# EAGLE design CV_slew_limiter copy (EAGLE 6.1)
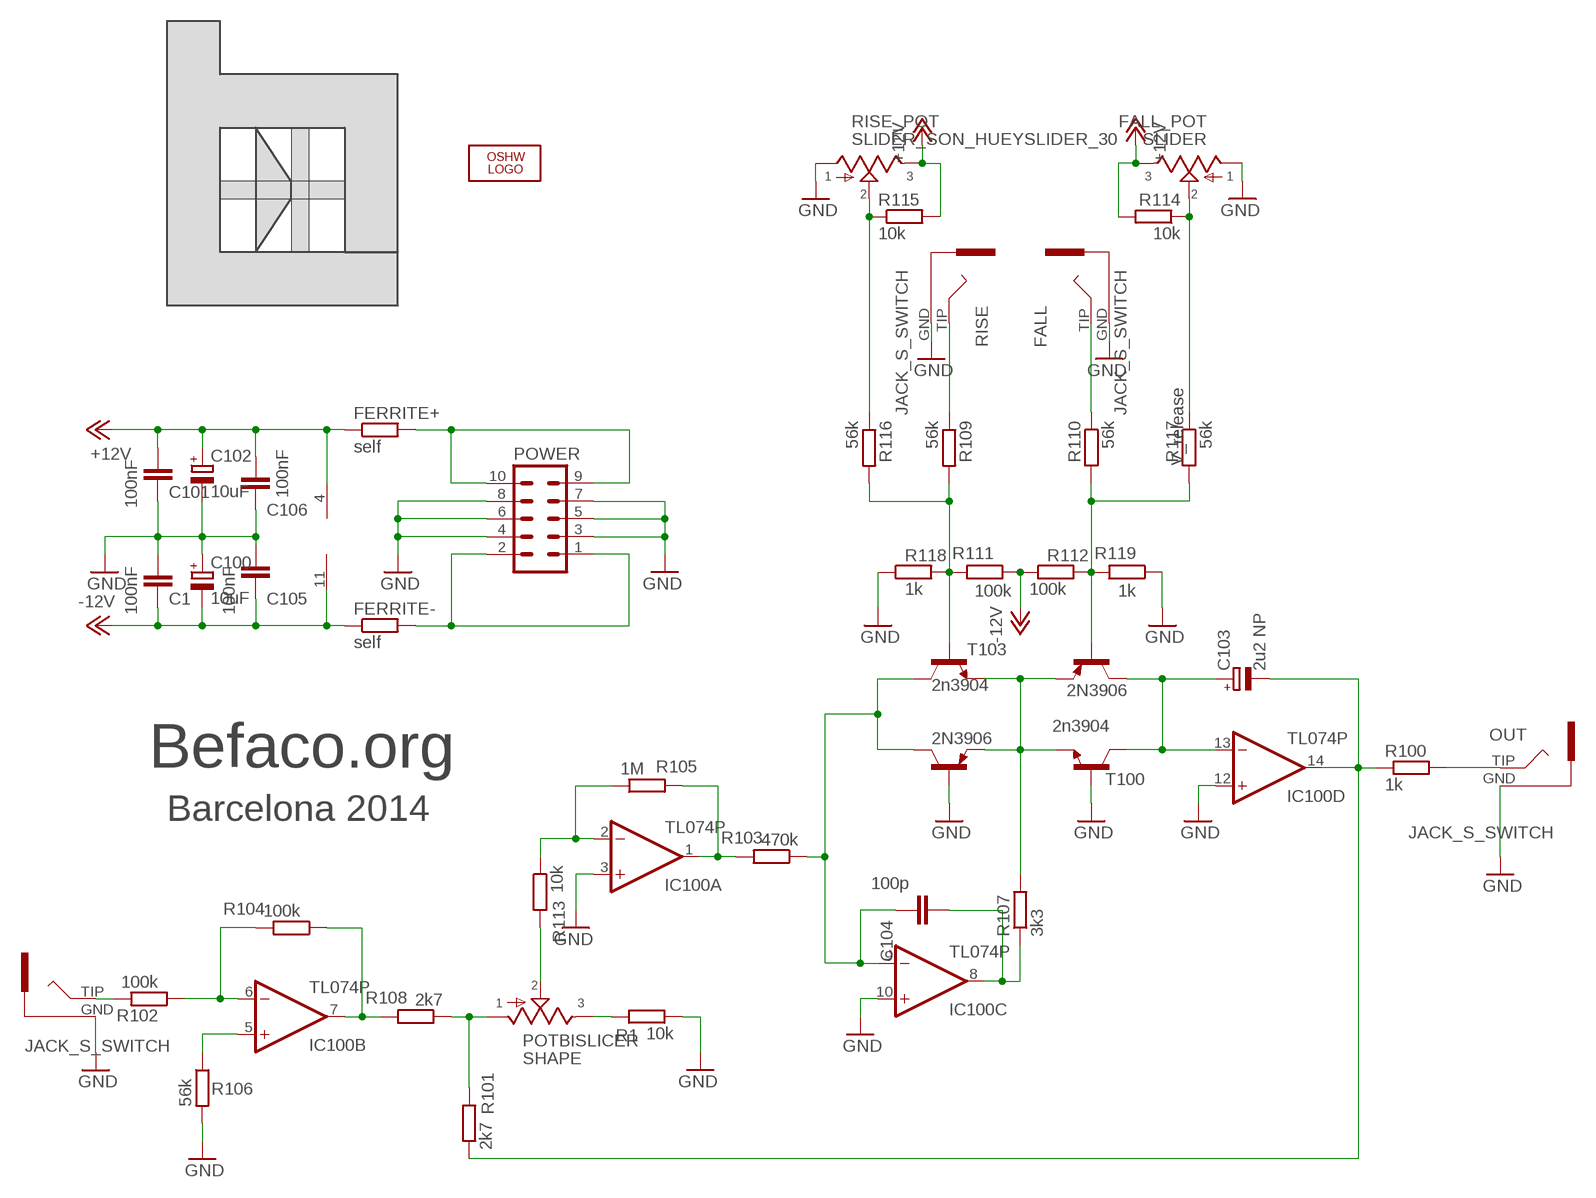
[diagram p0: schematic, sheet 1]

## Parts
C1  100nF  C-EU050-025X075  [C050-025X075]
C100  10uF  CPOL-EUE2-4  [E2-4]
C101  100nF  C-EU050-025X075  [C050-025X075]
C102  10uF  CPOL-EUE2-4  [E2-4]
C103  2u2 NP  CPOL-EUE2-4  [E2-4]
C104  100p  C-EU050-025X075  [C050-025X075]
C105  100nF  C-EU050-025X075  [C050-025X075]
C106  100nF  C-EU050-025X075  [C050-025X075]
FALL  JACK_S_SWITCH  [PJ-360_BANANA_2]
FALL_POT  SLIDER  SLIDER_SON_HUEYSLIDER_30  [SILDER_30]
FERRITE+  self  R-EU_0204/5  [0204/5]
FERRITE-  self  R-EU_0204/5  [0204/5]
IC100  TL074P  [DIL14]
IN  JACK_S_SWITCH  [PJ-360_BANANA_2]
LOGO100  OSHW_LOGO_8MILX0200-NT  [OSHW_8X200_NOTEXT]
OUT  JACK_S_SWITCH  [PJ-360_BANANA_2]
POWER  ML10  [ML10]
R1  10k  R-EU_0204/5  [0204/5]
R100  1k  R-EU_0204/5  [0204/5]
R101  2k7  R-EU_0204/5  [0204/5]
R102  100k  R-EU_0204/5  [0204/5]
R103  470k  R-EU_0204/5  [0204/5]
R104  100k  R-EU_0204/5  [0204/5]
R105  1M  R-EU_0204/5  [0204/5]
R106  56k  R-EU_0204/5  [0204/5]
R107  3k3  R-EU_0204/5  [0204/5]
R108  2k7  R-EU_0204/5  [0204/5]
R109  56k  R-EU_0204/5  [0204/5]
R110  56k  R-EU_0204/5  [0204/5]
R111  100k  R-EU_0204/5  [0204/5]
R112  100k  R-EU_0204/5  [0204/5]
R113  10k  R-EU_0204/5  [0204/5]
R114  10k  R-EU_0204/5  [0204/5]
R115  10k  R-EU_0204/5  [0204/5]
R116  56k  R-EU_0204/5  [0204/5]
R117  56k  R-EU_0204/5  [0204/5]
R118  1k  R-EU_0204/5  [0204/5]
R119  1k  R-EU_0204/5  [0204/5]
RISE  JACK_S_SWITCH  [PJ-360_BANANA_2]
RISE_POT  SLIDER_SON_HUEYSLIDER_30  [SILDER_30]
SHAPE  POTBISLICER  [POTBISLICER]
T100  2n3904  2N3904-NPN-TO92-EBC  [TO92-EBC]
T101  2N3906  2N3906-PNP-TO92-EBC  [TO92-EBC]
T102  2N3906  2N3906-PNP-TO92-EBC  [TO92-EBC]
T103  2n3904  2N3904-NPN-TO92-EBC  [TO92-EBC]
U$100  LOGOBEFACOCONLETRAS  [LOGOBEFACOCONLETRAS_2]

## Nets
+12V: C101.2 C102.+ C106.2 FALL_POT.3 FERRITE+.1 IC100.4(P:V+) R114.2 R115.2 RISE_POT.3
-12V: C1.1 C100.- C105.1 FERRITE-.1 IC100.11(P:V-) R111.1 R112.1
GND: C1.2 C100.+ C101.1 C102.- C105.2 C106.1 FALL.GND FALL_POT.1 IC100.3(A:+IN) IC100.10(C:+IN) IC100.12(D:+IN) IN.GND OUT.GND POWER.3 POWER.4 POWER.5 POWER.6 POWER.7 POWER.8 R1.1 R106.2 R118.1 R119.1 RISE.GND RISE_POT.1 T100.B T102.B
IC25: C103.- IC100.14(D:OUT) R100.1 R101.1
N$1: OUT.TIP R100.2
N$2: R113.2 SHAPE.PIN2
N$3: R101.2 R108.1 SHAPE.PIN1
N$8: FERRITE+.2 POWER.9 POWER.10
N$10: R107.2 T100.E T101.E T102.E T103.E
N$12: C103.+ IC100.13(D:-IN) T100.C T101.C
N$21: IC100.2(A:-IN) R105.1 R113.1
N$22: C104.1 IC100.9(C:-IN) R103.1 T102.C T103.C
N$23: C104.2 IC100.8(C:OUT) R107.1
N$24: R109.1 RISE.TIP
N$28: IC100.1(A:OUT) R103.2 R105.2
N$29: R1.2 SHAPE.PIN3
N$30: IC100.7(B:OUT) R104.1 R108.2
N$33: FERRITE-.2 POWER.1 POWER.2
N$35: IC100.6(B:-IN) R102.1 R104.2
N$37: IC100.5(B:+IN) R106.1
N$39: IN.TIP R102.2
N$46: R115.1 R116.1 RISE_POT.2
N$49: FALL_POT.2 R114.1 R117.1
N$51: FALL.TIP R110.1
TO_ATTACK_CV: R109.2 R111.2 R116.2 R118.2 T103.B
TO_DECCAY_CV: R110.2 R112.2 R117.2 R119.2 T101.B

## Notes on the sheet
- V_release
- Befaco.org
- Barcelona 2014

## Library data of the parts
C1 C101 C104-C106 = rcl:C-EU: CAPACITOR, European symbol
C100 C102 C103 = rcl:CPOL-EU: POLARIZED CAPACITOR, European symbol
FALL IN OUT RISE = minijack_banana:JACK_S_SWITCH
FALL_POT RISE_POT = slider_son_huey:SLIDER_SON_HUEY
FERRITE+ FERRITE- R1 R100-R119 = rcl:R-EU_: RESISTOR, European symbol
IC100 = linear:TL074: OP AMP
LOGO100 = ohw-logo:OSHW_LOGO_8MIL
POWER = con-ml:ML10: HARTING; OC_FARNELL: unknown; OC_NEWARK: unknown
SHAPE = Por bislicer2:POTBISLICER
T100 T103 = transistor-neu-to92:*-NPN-: NPN Transistror
T101 T102 = transistor-neu-to92:*-PNP-: PNP Transistror
U$100 = logo befaco:LOGOBEFACOCONLETRAS

## Board
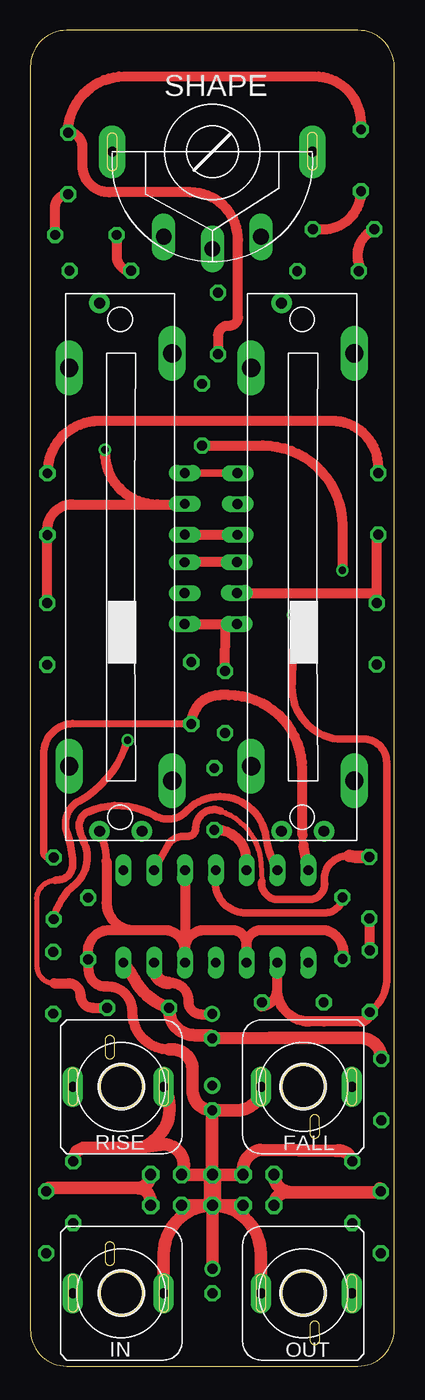
[diagram p1: board, top side]
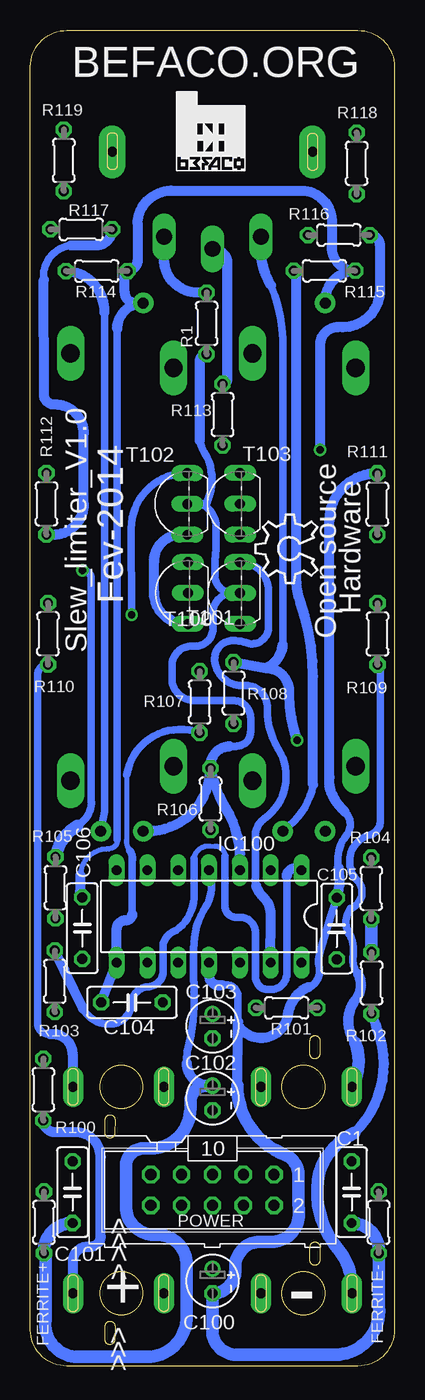
[diagram p2: board, bottom side, seen from below]

Size 30 x 110 mm. Coordinates in mm from the lower left corner, seen from the top.
Outline: 0,107 0,3 arc90 3,0 27,0 arc90 30,3 30,107 arc90 27,110 3,110 arc90 0,107
Copper layers (1*16): Top 0.035mm / dielectric 1.5mm / Bottom 0.035mm
Design rules: minimum track width 6mil, minimum drill 12mil, track to track 6mil, track to pad 6mil, pad to pad 6mil, via to via 6mil, smd to smd 0mil, copper to edge 10mil, drill to drill 10mil, minimum pad ring 10mil, minimum via ring 6mil, stop-mask expansion 2mil, vias tented up to drill 100mil, thermal gap 10mil

### Footprints (pad centres in the part's own frame; a part is rotated, then mirrored left to right if it is on the bottom)
C050-025X075 = drill 0.813 octagon: 1 -2.54,0; 2 2.54,0
E2-4 = drill 0.813 pad 1.27: + -1.016,0 | drill 0.813 pad 1.27 octagon: - 1.016,0
PJ-360_BANANA_2 = drill 0.8 pad 1.676 long: GND 0,-3.5; TIP 0,4
SILDER_30 = drill 0.9 pad 1.676: 1 -21.75,1.8; 2 -21.75,-1.7; 3 21.75,1.8 | drill 1.5 long: P$4 -17.6,-4.2; P$5 -16.4,4.3; P$6 16.4,4.3; P$7 17.6,-4.2
0204/5 = drill 0.813 octagon: 1 -2.54,0; 2 2.54,0
DIL14 = drill 0.813 long: 1 -7.62,-3.81; 2 -5.08,-3.81; 3 -2.54,-3.81; 4 0,-3.81; 5 2.54,-3.81; 6 5.08,-3.81; 7 7.62,-3.81; 8 7.62,3.81; 9 5.08,3.81; 10 2.54,3.81; 11 0,3.81; 12 -2.54,3.81; 13 -5.08,3.81; 14 -7.62,3.81
ML10 = drill 0.914 octagon: 1 -5.08,-1.27; 2 -5.08,1.27; 3 -2.54,-1.27; 4 -2.54,1.27; 5 0,-1.27; 6 0,1.27; 7 2.54,-1.27; 8 2.54,1.27; 9 5.08,-1.27; 10 5.08,1.27
POTBISLICER = drill 0.8 pad 2.184 long: PCB1 -8.25,0; PCB2 8.25,0 | drill 1.3 pad 1.778 long: PIN1 -4,-7; PIN2 0,-8; PIN3 4,-7
TO92-EBC = drill 0.813 long: B 0,-1.27; C 2.54,-1.27; E -2.54,-1.27

### Placement (x,y rotation side)
C1  3.53,14.32 90 bottom
C100  15,7 270 bottom
C101  26.53,14.32 270 bottom
C102  14.99,22.08 270 bottom
C103  14.99,28 270 bottom
C104  21.64,29.95 180 bottom
C105  4.76,36.03 270 bottom
C106  25.73,36.06 90 bottom
FALL  22.5,23 270 top
FALL_POT  22.5,65.8 90 top
FERRITE+  28.89,11.84 90 bottom
FERRITE-  1.3,11.84 90 bottom
IC100  15.28,37.03 180 bottom
IN  7.5,6 90 top
LOGO100  6.37,64.48 90 bottom
OUT  22.5,6 270 top
POWER  15,14.5 180 bottom
R1  15.48,85.87 90 bottom
R100  28.94,22.77 270 bottom
R101  8.88,29.5 0 bottom
R102  1.89,31.56 270 bottom
R103  27.99,31.69 90 bottom
R104  1.91,39.34 270 bottom
R105  27.94,39.4 270 bottom
R106  15.16,46.7 90 bottom
R107  16.05,54.69 90 bottom
R108  13.27,55.43 270 bottom
R109  1.39,60.3 90 bottom
R110  28.55,60.3 90 bottom
R111  1.41,70.98 270 bottom
R112  28.68,71.01 270 bottom
R113  14.16,78.35 90 bottom
R114  24.53,90.18 0 bottom
R115  5.76,90.2 0 bottom
R116  4.58,93.15 0 bottom
R117  25.81,93.61 0 bottom
R118  3.12,99.05 270 bottom
R119  27.26,99.3 270 bottom
RISE  7.5,23 90 top
RISE_POT  7.5,65.8 90 top
SHAPE  15,100 0 top
T100  13.99,63.66 90 bottom
T101  18.3,63.66 90 bottom
T102  18.35,71 90 bottom
T103  14,71.01 90 bottom
U$100  15.37,101.12 0 bottom

### Tracks (layer width: path | path; a pad name or v marks a point on that pad's centre or on a via)
+12V
  Top 0.61: IC100.4 15.24,40.01 arc90 17.58,37.34 24.12,37.34 arc90 C106.2
  Bottom 0.406: 22.85,43.36 arc90 23.35,42.65 23.52,42.58 arc-90 25.89,40.43 | 16.54,31.69 16.54,31.59
  Bottom 0.61: RISE_POT.3 5.7,87.72 | IC100.4 arc55 15.74,37.53 arc-31 16.54,34.35 16.54,31.69 | 22.85,43.36 22.85,85.4 | FALL_POT.3 21.37,87.55 | 22.22,90.18 arc-90 R114.2 | 16.54,31.79 16.54,31.59 16.52,30.74 arc16 17.03,26.15 arc-21 17.11,24.94
  Bottom 0.813: 5.7,87.72 arc90 R115.2 arc90 5.18,92.16 5.18,93.89 arc-90 7.38,96.79 18.18,96.79 arc-90 21.19,94.15 21.17,91.23 arc90 R114.2 | 25.89,40.43 25.89,39.15 arc-90 C106.2 | 22.85,85.4 arc90 FALL_POT.3 | 21.37,87.55 arc90 22.22,88.4 22.22,90.18 | C102.+ 15.27,23.1 arc90 17.11,24.94
  Bottom 1.016: 15.27,23.1 15.5,23.1 arc-90 16.82,21.78 16.82,21.22 arc90 20.11,17.92 20.69,17.92 arc-90 22.14,16.48 22.14,13.14 arc-90 19.81,10.82 19.55,10.82 arc90 17.14,8.41 17.14,4.42 arc90 20.1,0.77 26.37,0.77 arc90 28.75,3.8 28.75,9.16 arc-90 FERRITE+.1 28.89,9.42 arc90 C101.2
-12V
  Top 0.813: R112.1 28.68,74.03 arc90 24.87,77.83 5.63,77.83 arc90 R111.1
  Bottom 0.61: 12.88,28.38 12.89,30.36 arc-90 13.79,31.39 14.19,31.39 | 4.62,41.03 arc50 3.96,43.7 arc-86 4.1,45.67 | C105.1 arc-3 6.16,34.08 arc-27 6.21,32.79 arc80 7.05,31.21
  Bottom 0.813: 12.96,23.13 12.89,28.08 | 12.89,28.08 12.88,28.38 | 14.19,31.39 arc90 15.23,31.91 15.22,33.2 arc-90 IC100.11 | C105.1 arc-31 4.62,41.03 | 4.1,45.67 arc21 5.12,47.04 arc33 5.35,48.49 5.35,69.67 arc90 R111.1 | 7.05,31.21 arc-61 8.78,28.97 arc141 12.89,28.08
  Bottom 1.016: 12.96,23.13 arc-66 9.33,17.53 arc67 7.91,15.96 arc-4 7.88,12.55 arc93 10.14,10.23 11.07,10.23 arc-90 13.12,8.18 13.12,7.86 arc90 C100.- 15,3.15 arc-90 13.23,0.95 4.58,0.95 arc-90 1.27,4.88 1.27,9.27 arc-90 FERRITE-.1 1.3,9.55 arc-90 C1.1
GND
  Top 0.61: 27.22,101.87 arc90 R119.1 | POWER.7 17.54,15.81 | 4.75,33.53 arc90 C105.2 arc-90 4.79,33.49 | 6.28,41.59 arc26 RISE_POT.1
  Top 0.813: 27.22,101.87 27.22,102.42 arc90 23.43,106.21 7.74,106.21 arc90 R118.1 arc-90 4.3,100.41 4.3,98.88 arc90 6.51,96.67 13.2,96.67 arc-90 17.11,92.75 17.11,86.37 arc-90 16.42,85.68 16.29,85.68 arc90 15.48,84.86 R1.1 | 4.75,33.53 4.75,34.15 arc-90 6.52,35.91 8.53,35.91 | 8.53,35.91 11.04,35.91 arc-90 12.73,34.22 12.73,33.37 arc-90 IC100.12 | IC100.12 12.72,34.28 arc-90 14.35,35.91 16.64,35.91 arc-90 17.79,34.76 17.79,33.37 arc90 IC100.10 17.8,34.67 arc-90 19.04,35.91 24.34,35.91 arc-90 C106.1 | IC100.3 IC100.12 | 6.28,41.59 6.28,38.16 arc90 8.53,35.91 | 11.44,26.07 arc-90 8.42,29.09 8.42,29.23 arc90 6.4,31.25 6.19,31.25 arc-90 4.81,32.63 4.81,33.48 arc90 C105.2
  Top 1.016: 17.54,15.81 arc-90 18.92,17.8 25.19,17.73 arc-90 C101.1 | POWER.4 POWER.6 | POWER.6 POWER.8 | POWER.5 POWER.7 15.03,15.77 arc90 15,15.74 | POWER.5 POWER.3 arc126 10.68,18.24 8.95,17.97 | POWER.5 arc90 POWER.5 | 8.95,17.97 arc106 RISE.GND | IN.GND 11,9.23 arc-90 POWER.6 | OUT.GND 19,9.23 arc90 POWER.6 | C100.+ POWER.6 | C102.- POWER.5 arc90 POWER.5 | C102.- 17.07,21.07 arc90 FALL.GND | 11.44,26.07 11.75,26.07 arc-90 13.37,24.45 13.37,22.69 arc90 C102.- | C1.2 3.53,16.95 arc-90 4.55,17.98 8.94,17.98 arc-90 8.95,17.97
  Top 1.422: POWER.6 POWER.5
  Bottom 0.61: T102.B 16.02,71.05 | 16.02,71.05 arc66 14.71,69.2 arc7 14.79,66.36 arc-90 14.81,66.33 14.81,65.15 arc-90 13.31,63.66 | 16.04,76.22 arc-26 15.44,74.86 arc50 15.51,70.99 arc-21 16.02,71.05 | T100.B 13.31,63.66 | 13.31,63.66 arc-90 14.96,62.01 14.96,60.73 arc90 16.4,59.29 16.71,59.29 arc-90 18.34,57.66 18.34,56.64 arc-90 16.51,54.81 13.31,54.81 arc90 11.84,53.35 11.84,52.28 arc90 13.08,51.04 13.56,51.04 | R106.2 15.16,49.44
  Bottom 0.813: FALL_POT.1 20.35,44.05 arc-90 R106.2 arc-22 13.63,45.51 arc33 IC100.3 | 15.16,49.44 arc90 13.56,51.04 | 16.04,76.22 16.04,82.77 arc90 R1.1
IC25
  Top 1.016: IC100.14 arc-6 8.59,31.84 arc43 R101.1 11.42,29.41 arc90 13.58,27.25 14.72,27.25 arc-90 C103.- 19.76,27.02 27.23,27.02 arc-90 R100.1
N$1
  Bottom 0.813: OUT.TIP 26.5,8.63 arc90 25.29,9.84 25.05,9.84 arc-90 24.21,10.69 24.21,17.2 arc-90 26.27,19.26 27.97,19.26 arc90 R100.2
N$2
  Bottom 0.813: SHAPE.PIN2 arc90 13.77,90.84 arc-90 13.78,90.82 13.78,81.27 arc90 R113.2
N$3  (via drill 0.6 pad 1.02)
  Top 0.406: 2.05,40.01 arc90 0.54,38.41 0.54,33.01 arc90 1.93,31.52
  Top 0.61: v8.02,51.54 arc-44 4.05,46.55 arc82 3.02,43.91 arc-20 3.5,41.21 arc-90 2.12,40.04 2.05,40.01 | R101.2 5.49,29.51
  Top 0.813: 1.93,31.52 3.15,31.52 arc-90 4.13,30.54 arc90 5.17,29.51 R101.2
  Bottom 0.61: 9.2,59.42 9.21,83.68 arc-25 10.17,88.98
  Bottom 0.813: R108.1 10.58,57.48 | 10.58,57.48 arc-62 9.2,59.42 | 10.17,88.98 arc35 SHAPE.PIN1 | v8.02,51.54 arc17 8.68,55.26 arc-97 10.58,57.48
N$8
  Top 1.016: FERRITE+.2 28.82,14.64 arc-90 28.49,14.32 21.53,14.32 | 21.53,14.32 arc-90 POWER.9 | POWER.10 arc-90 21.17,14.32 21.53,14.32
N$10
  Top 0.61: T101.E arc-90 T101.E 16.01,61.12 arc-90 16.08,61.04 | 17.02,68.47 arc90 T102.E
  Top 0.813: T100.E 16.01,61.12 | T103.E 17.02,68.47 | R107.2 16.08,61.04
  Bottom 0.813: T101.E 17.25,61.12 arc90 19.8,63.68 19.8,66.29 arc90 17.61,68.49 17.07,68.49 arc-90 T102.E
N$12
  Top 0.61: T100.C arc90 T100.C
  Top 0.813: T101.C T100.C | 11.38,31.57 11.57,31.57 arc-90 13.03,30.11 13.03,30.02 arc90 14.06,28.98 14.96,28.98 arc90 C103.+
  Top 1.016: IC100.13 10.19,32.77 arc90 11.38,31.57
  Bottom 0.61: 11.4,39.56 arc25 11.47,40.16 11.47,43.62 arc54 10.71,45.09 arc-86 9.56,50.78 arc33 10.48,54.2 arc-96 12.42,56.05 arc90 14.81,58.12 arc93 13.31,59.75 arc21 12.24,59.57 arc-118 10.38,61.05 10.38,63.86 arc-90 T100.C
  Bottom 0.813: IC100.13 10.2,37.26 arc-47 10.77,38.58 arc28 11.4,39.56
N$21  (via drill 0.6 pad 1.02)
  Top 0.406: 15.67,45.72 arc-59 18.91,42.1 arc-11 19.07,39.92
  Top 0.61: IC100.2 11.41,43.05 arc-58 12.84,43.62 arc97 13.63,44.33 arc-112 15.67,45.72 | 19.07,39.92 arc96 20.4,38.42 23.09,38.42 arc90 23.09,38.42 arc96 24.23,39.96 arc-99 26.29,42
  Top 0.813: R113.1 19.16,75.81 arc-90 25.72,69.25 v25.72,65.53 arc-90 v25.71,65.53
  Top 1.016: 26.29,42 arc12 R105.1
  Bottom 0.61: 26.15,44.48 arc-53 24.96,46.36 24.96,46.4 arc-90 24.98,46.42 24.98,64.8 arc-90 v25.71,65.53
  Bottom 1.016: 26.15,44.48 arc-47 R105.1
N$22  (via drill 0.6 pad 1.02)
  Top 0.61: T103.C 17.02,73.56 arc90 T102.C | v21.67,61.88 arc90 21.74,61.81 21.6,56.35 arc90 25.34,51.63 27.47,51.63 arc-90 29.36,49.74 29.36,40.39 arc0 29.39,32.04 arc-53 R103.1
  Top 0.813: C104.1 18.97,29.64 arc90 20.35,31.02 | 20.35,31.02 20.35,33.36 arc90 IC100.9 | R103.1 arc-90 27.21,28.37 24.23,28.37 22.99,28.37 arc-90 20.35,31.02
  Bottom 0.61: v21.67,61.88 21.69,68.98 arc90 T102.C
N$23
  Bottom 0.406: 22.06,48.7 22.06,43.38 arc-40 21.82,42.46
  Bottom 0.61: 22.06,48.7 arc101 R107.1 | 22.19,36.71 22.13,36.71 | 21.6,37.24 21.6,41.74 | 21.6,41.74 arc-90 21.61,41.74 | 21.6,41.74 arc-90 21.6,41.75 arc-35 21.82,42.46
  Bottom 0.813: C104.2 IC100.8 22.89,36.01 arc90 22.19,36.71 | 22.13,36.71 arc-90 21.6,37.24
N$24
  Bottom 0.61: 3,32.28 arc50 3.41,33.8 arc-34 3.66,35.45 arc72 3.62,37.69 arc-102 2.9,39.85 arc124 2.01,43.75 arc-66 1.17,44.75 1.17,57.53 arc-90 R109.1 arc-90 1.4,57.75
  Bottom 0.813: 3,32.28 arc73 3.34,30.01 arc-70 3.22,26.61
  Bottom 1.016: 3.22,26.61 arc49 RISE.TIP
N$28
  Top 0.813: R103.2 27.99,36.81 arc90 R105.2
  Bottom 0.406: 16.52,41.81 arc90 15.18,42.82 14.79,42.81 arc90 13.96,42.02
  Bottom 0.61: 16.52,41.81 16.52,39.21 arc60 18,35.87 arc-59 19.06,34.75 19.06,32.67 arc95 20.35,31.24 arc-87 21.68,29.7 arc72 23.14,28.2 arc72 25.67,29.45 | 8.88,40.33 8.88,32.31 arc90 10.18,31 10.38,31 arc90 11.46,32.09 11.46,35.71 arc-90 12.71,36.96 13.06,36.96 arc90 13.96,37.9 13.96,42.02
  Bottom 0.813: 25.67,29.45 arc0 R103.2 | IC100.1 8.23,40.98 arc-90 8.88,40.33
N$29
  Bottom 0.61: SHAPE.PIN3 arc-90 SHAPE.PIN3
  Bottom 0.813: SHAPE.PIN3 18.99,91.17 arc-90 16.23,88.41 R1.2
N$30
  Top 0.61: R108.2 3.5,52.91 arc90 1.1,50.41 1.1,42.25 arc90 R104.1 | 22.52,42.88 arc-27 22.43,43.71
  Top 0.813: IC100.7 22.52,42.88 | 22.43,43.71 22.41,49.15 arc90 16.35,55.25 15.63,55.25 arc90 R108.2
N$33
  Top 1.016: 8.81,14.66 arc90 POWER.1 | 8.81,14.66 arc-90 9.92,13.56 POWER.2 | 8.81,14.66 1.53,14.66 arc-90 FERRITE-.2
N$35
  Top 0.61: IC100.6 arc-22 19.43,43.52 arc133 12.71,45.54 arc-70 10.24,45.33 arc54 4.76,45.65 arc80 4.06,44.23 arc10 4.45,43.05 arc-71 3.73,39.71 arc38 R104.2
  Bottom 1.016: R102.1 R104.2
N$37
  Top 0.813: R106.1 15.35,44.16 arc-90 17.79,41.72 17.79,41 arc90 IC100.5
N$39
  Bottom 0.813: 3.31,19.21 arc-67 1.39,27.69 arc-4 R102.2
  Bottom 1.016: 3.31,19.21 arc-46 6.21,15.94 arc-52 4.67,9.68 arc44 IN.TIP
N$46
  Top 0.813: R116.1 7.12,91.38 arc90 R115.1
  Bottom 0.61: RISE_POT.2 9.05,44.21 arc-45 6.72,47.86
  Bottom 0.813: 6.72,47.86 6.72,56.82 arc-19 7.76,62.92 arc25 8.06,65.33 8.06,89.96 arc-90 R115.1
N$49
  Top 0.813: R114.1 27.18,90.53 arc-90 R117.1
  Bottom 0.61: FALL_POT.2 23.89,45.66 23.89,86.77
  Bottom 0.813: 23.89,86.77 arc-90 R114.1
N$51
  Bottom 0.61: 28.38,27.35 28.52,27.35 arc90 29.4,28.23 29.4,56.92 arc90 R110.1
  Bottom 0.813: 28.38,27.35 28.17,27.35 arc90 26.54,25.71 26.54,23.04 arc-90 FALL.TIP
TO_ATTACK_CV  (via drill 0.6 pad 1.02)
  Top 0.61: 1.39,68.43 arc-90 R111.2
  Top 0.813: R109.2 1.39,68.43 | R116.2 2.04,95.43 arc-90 R118.2 | 10.45,70.96 8.02,70.96 arc90 8.01,70.97 3.47,70.97 arc90 1.41,68.91 R111.2 | 10.45,70.96 12.56,70.96 arc90 T103.B | v6.13,75.46 6.13,75.28 arc90 10.45,70.96
  Bottom 0.813: R116.2 arc90 1.2,92.31 1.2,88.62 arc90 4.27,85.55 4.67,85.55 arc-90 6.14,84.08 v6.14,75.46 arc-90 v6.13,75.46
TO_DECCAY_CV
  Top 0.61: 28.55,68.34 arc-90 R112.2 | 28.52,63.66 arc90 28.55,63.7
  Top 0.813: R110.2 28.55,63.7 28.55,68.34 | T101.B 28.52,63.66 | R117.2 24.11,93.61 arc90 R119.2
  Bottom 0.61: R112.2 28.13,68.47 | 27.96,79.18 28.06,79.18 | 28.9,89.46 arc90 26.67,92.29
  Bottom 0.813: 28.13,68.47 arc-90 25.6,71.01 25.6,76.82 arc-90 27.96,79.18 | 28.06,79.18 arc90 28.89,80.01 28.9,89.46 | 26.67,92.29 24.6,92.29 arc-90 R117.2

### Text on the board
bPlace: BEFACO.ORG | Open source | Hardware | Fev-2014 | Slew_limiter_V1.0 | > | > | > | > | > | > | >
bNames: + | -